# EAGLE design On_Off (EAGLE 7.7.0)
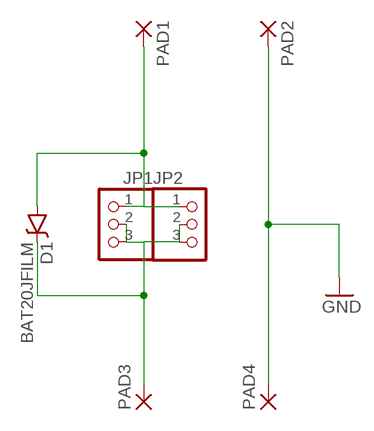
[diagram p0: schematic, sheet 1]

## Parts
D1  BAT20JFILM  [SOD-323]
JP1  PINHD-1X3  [1X03]
JP2  PINHD-1X3  [1X03]
PAD1  SMD5  [SMD2,54-5,08]
PAD2  SMD5  [SMD2,54-5,08]
PAD3  SMD5  [SMD2,54-5,08]
PAD4  SMD5  [SMD2,54-5,08]

## Nets
BATTERY: D1.C JP1.2 JP1.3 JP2.2 JP2.3 PAD3.1(P)
FEATHER: D1.A JP1.1 JP2.1 PAD1.1(P)
GND: PAD2.1(P) PAD4.1(P)

## Library data of the parts
D1 = SparkFun-DiscreteSemi:BAT20JFILM: 23V, 1A Schottky diode, SOD-323 package; PROD_ID: DIO-11623
JP1 JP2 = pinhead:PINHD-1X3: PIN HEADER
PAD1-PAD4 = wirepad:SMD5: SMD PAD

## Board
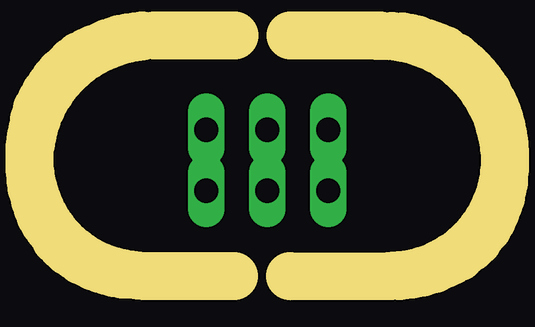
[diagram p1: board, top side]
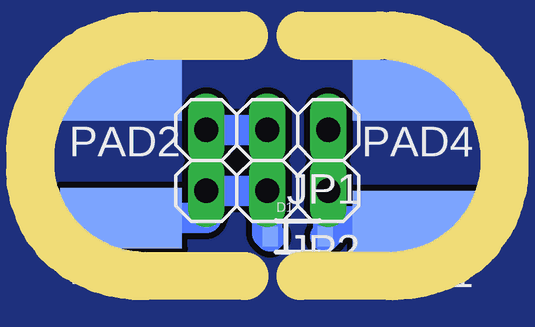
[diagram p2: board, bottom side, seen from below]

No outline drawn. Coordinates in mm, seen from the top.
Copper layers (1*16): Top 0.035mm / dielectric 1.5mm / Bottom 0.035mm
Design rules "default": minimum track width 10mil, minimum drill 24mil, track to track 8mil, track to pad 8mil, pad to pad 8mil, via to via 8mil, smd to smd 8mil, copper to edge 40mil, drill to drill 8mil, minimum pad ring 10mil, minimum via ring 8mil, stop-mask expansion 4mil, vias tented up to drill 0mil, thermal gap 10mil
Milling: 190 lines

### Footprints (pad centres in the part's own frame; a part is rotated, then mirrored left to right if it is on the bottom)
SOD-323 = smd 0.63 x 0.83: A 1.15,0; C -1.15,0
1X03 = drill 1.016 long: 1 -2.54,0; 2 0,0; 3 2.54,0
SMD2,54-5,08 = smd 2.54 x 5.08: 1 0,0

### Placement (x,y rotation side)
D1  7.62,0.64 0 bottom
JP1  8.89,5.08 180 bottom
JP2  8.89,2.54 180 bottom
PAD1  2.79,1.27 90 bottom
PAD2  14.99,6.73 90 bottom
PAD3  14.99,1.4 90 bottom
PAD4  2.79,6.73 90 bottom

### Tracks (layer width: path | path; a pad name or v marks a point on that pad's centre or on a via)
BATTERY
  Bottom 1.27: JP2.2 JP1.2 JP1.3 JP2.3 | JP2.2 JP2.3 | PAD3.1 11.43,1.4 JP2.3 | JP2.2 8.89,0.76 D1.C
FEATHER
  Bottom 1.27: PAD1.1 6.35,1.27 | 6.35,1.27 JP2.1 JP1.1 | 6.35,1.27 6.35,0.76 D1.A
GND
  pour Bottom (isolate 0.254, no thermals): -5.08,-5.08 24.13,-5.08 24.13,12.7 -5.08,12.7